# EAGLE design relay (EAGLE 7.0.0)
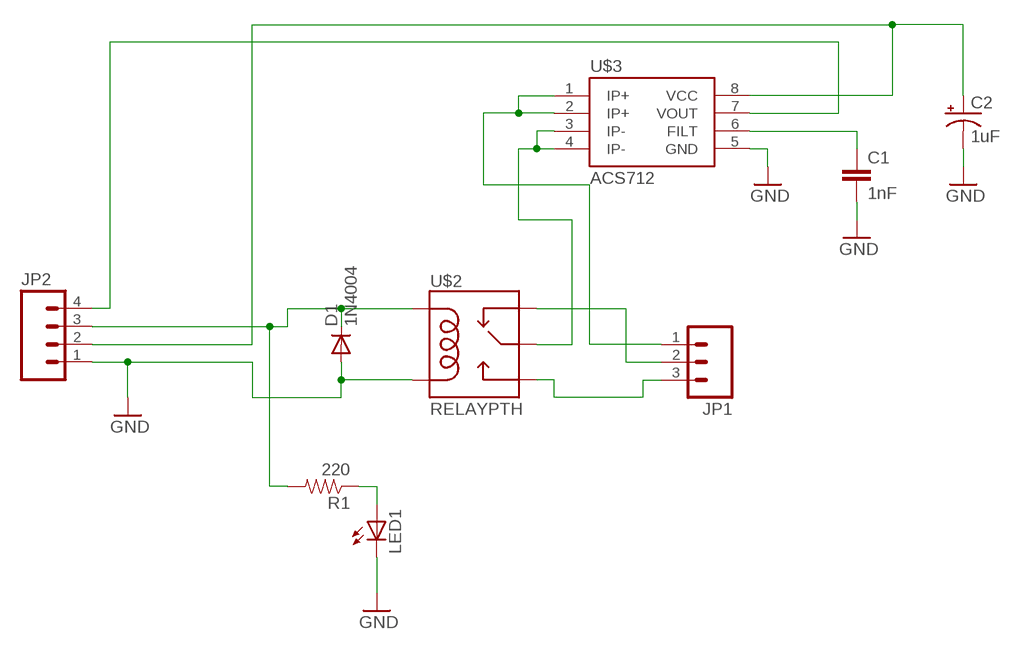
[diagram p0: schematic, sheet 1]

## Parts
C1  1nF  CAPKIT  [CAP-PTH-SMALL-KIT]
C2  1uF  CAP_POLPTH2  [CPOL-RADIAL-10UF-25V]
D1  1N4004  [DO41-10]
JP1  M03SCREW  [SCREWTERMINAL-3.5MM-3]
JP2  M04PTH  [1X04]
LED1  LED3MM  [LED3MM]
R1  220  RESISTORAXIAL-0.3  [AXIAL-0.3]
U$2  RELAYPTH  [RELAY-G5Q]
U$3  ACS712  [SO08]

## Nets
GND: C1.2 C2.2(-) D1.A JP2.1 LED1.K(C) U$2.1(COIL2) U$3.5(GND)
N$1: LED1.A R1.P$1
N$2: D1.C JP2.3 R1.P$2 U$2.5(COIL1)
N$3: C1.1 U$3.6(FILT)
N$4: JP1.2 U$2.4(NC)
N$5: U$2.2(MAIN) U$3.3(IP-) U$3.4(IP-)
N$6: JP1.1 U$3.1(IP+) U$3.2(IP+)
N$7: JP1.3 U$2.3(NO)
N$9: C2.1(+) JP2.2 U$3.8(VCC)
N$19: JP2.4 U$3.7(VOUT)

## Library data of the parts
C1 = SparkFun-Capacitors:CAP: Capacitor Standard 0603 ceramic capacitor, and 0.1" leaded capacitor.
C2 = SparkFun-Capacitors:CAP_POL: Capacitor Polarized These are standard SMD and PTH capacitors. Normally 10uF, 47uF, and 100uF in electrolytic and tantalum varieties. Always verify the external diameter of the through hole cap, it varies with capacity, voltage, and manufacturer. The EIA devices should be standard.
D1 = adafruit:1N4004: DIODE General purpose 1N400x type rectifier (With bigger pads) http://www.ladyada.net/library/pcb/eaglelibrary.html
JP1 = SparkFun-Connectors:M03: Header 3 Standard 3-pin 0.1" header. Use with straight break away headers (SKU : PRT-00116), right angle break away headers (PRT-00553), swiss pins (PRT-00743), machine pins (PRT-00117), and female headers (PRT-00115). Molex polarized connector foot print use with SKU : PRT-08232 with associated crimp pins and housings.
JP2 = SparkFun-Connectors:M04: Header 4 Standard 4-pin 0.1" header. Use with straight break away headers (SKU : PRT-00116), right angle break away headers (PRT-00553), swiss pins (PRT-00743), machine pins (PRT-00117), and female headers (PRT-00115). Molex polarized connector foot print use with SKU : PRT-08231 with associated crimp pins and housings. 1MM SMD Version SKU: PRT-10208
LED1 = SparkFun-LED:LED: LEDs Standard schematic elements and footprints for 5mm, 3mm, 1206, and 0603 sized LEDs. 5mm - Spark Fun Electronics SKU : COM-00529 (and others)
R1 = SparkFun-Passives:RESISTOR: Resistor Basic schematic elements and footprints for 0603, 1206, and PTH resistors.
U$2 = SparkFun-Electromechanical:RELAY: SPDT relay (COM-00101)
U$3 = SparkFun-AnalogIC:ACS712: Hall-effect-based isolated linear current sensor

## Board
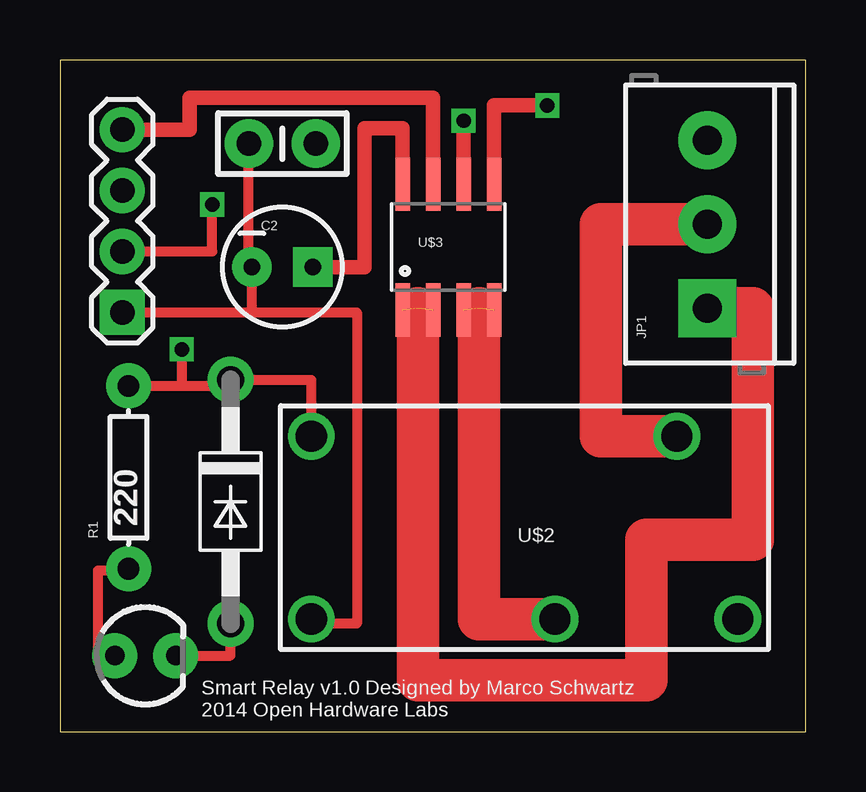
[diagram p1: board, top side]
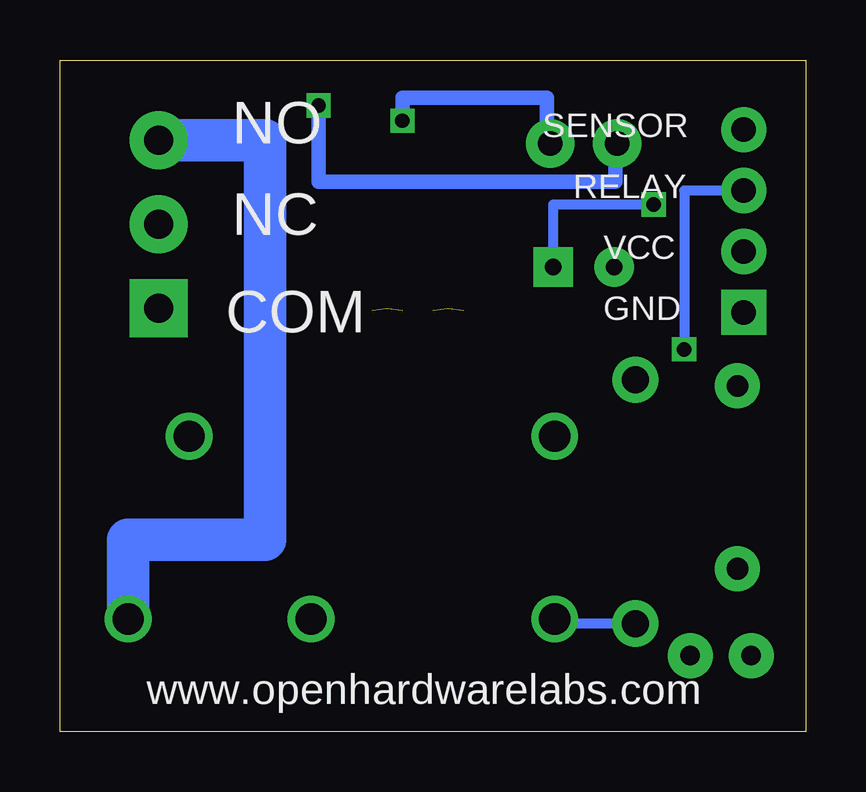
[diagram p2: board, bottom side, seen from below]

Size 31.1 x 27.99 mm. Coordinates in mm from the lower left corner, seen from the top.
Outline: 0,0 31.1,0 31.1,27.99 0,27.99 0,0
Copper layers (1*16): Top 0.035mm / dielectric 1.5mm / Bottom 0.035mm
Design rules "default": minimum track width 10mil, minimum drill 24mil, track to track 8mil, track to pad 8mil, pad to pad 8mil, via to via 8mil, smd to smd 8mil, copper to edge 40mil, drill to drill 8mil, minimum pad ring 10mil, minimum via ring 8mil, stop-mask expansion 4mil, vias tented up to drill 0mil, thermal gap 10mil

### Footprints (pad centres in the part's own frame; a part is rotated, then mirrored left to right if it is on the bottom)
CAP-PTH-SMALL-KIT = drill 1.016 pad 2.032: 1 -1.397,0; 2 1.397,0
CPOL-RADIAL-10UF-25V = drill 0.7 pad 1.651 square: 1 1.27,0 | drill 0.7 pad 1.651: 2 -1.27,0
DO41-10 = drill 1.118 pad 1.93: A 5.08,0; C -5.08,0
SCREWTERMINAL-3.5MM-3 = drill 1.2 pad 2.413 square: 1 0,0 | drill 1.2 pad 2.413: 2 3.5,0; 3 7,0
1X04 = drill 1.016 pad 1.88 square: 1 0,0 | drill 1.016 pad 1.88: 2 2.54,0; 3 5.08,0; 4 7.62,0
LED3MM = drill 0.813 pad 1.88: A -1.27,0; K 1.27,0
AXIAL-0.3 = drill 0.9 pad 1.88: P$1 -3.81,0; P$2 3.81,0
RELAY-G5Q = drill 1.3: 1 8.89,3.81; 2 -1.27,3.81; 3 -8.89,3.81; 4 -6.35,-3.81; 5 8.89,-3.81
SO08 = smd 0.61 x 2.21: 1 -1.905,-2.616; 2 -0.635,-2.616; 3 0.635,-2.616; 4 1.905,-2.616; 5 1.905,2.616; 6 0.635,2.616; 7 -0.635,2.616; 8 -1.905,2.616

### Placement (x,y rotation side)
C1  9.27,24.51 180 top
C2  9.27,19.37 0 top
D1  7.11,9.59 270 top
JP1  26.99,17.65 90 top
JP2  2.6,17.48 90 top
LED1  3.56,3.17 0 top
R1  2.86,10.6 90 top
U$2  19.37,8.51 180 top
U$3  16.19,20.19 0 top

### Tracks (layer width: path | path; a pad name or v marks a point on that pad's centre or on a via)
GND  (via drill 0.6)
  Top 0.406: LED1.K 7.11,3.17 D1.A | C1.2 7.87,19.37 C2.2 8,17.47 | JP2.1 8,17.47 | 8,17.47 12.38,17.47 12.38,4.51 10.48,4.51 U$2.1
  Top 0.61: v20.32,26.1 18.1,26.1 U$3.5
  Bottom 0.406: D1.A 10.48,4.51 U$2.1
  Bottom 0.61: C1.2 7.94,24.51 7.94,22.92 20.32,22.92 v20.32,26.1
N$1
  Top 0.406: LED1.A 1.59,3.17 1.59,6.73 2.86,6.73 R1.P$1
N$2  (via drill 0.6)
  Top 0.406: R1.P$2 5.08,14.41 | 5.08,14.41 7.11,14.41 D1.C 10.48,14.67 U$2.5 | v5.08,15.94 5.08,14.41
  Bottom 0.406: JP2.3 5.08,22.55 v5.08,15.94
N$3  (via drill 0.6)
  Top 0.61: v16.83,25.46 U$3.6
  Bottom 0.61: C1.1 10.79,24.51 10.79,26.42 16.83,26.42 v16.83,25.46
N$4
  Top 1.778: JP1.2 22.54,21.15 22.54,12.32 U$2.4
N$5  (2 unrouted)
  Top 1.778: U$2.2 17.46,4.7 17.46,17.65
N$6  (2 unrouted)
  Top 1.778: JP1.1 28.89,17.65 28.89,8 24.45,8 24.45,2.16 14.92,2.16 14.92,17.65
N$7
  Bottom 1.778: JP1.3 22.54,24.65 22.54,8 28.26,8 U$2.3
N$9  (via drill 0.6)
  Top 0.406: JP2.2 6.35,20.02 v6.35,21.97
  Top 0.61: C2.1 12.7,19.37 12.7,25.15 14.29,25.15 U$3.8
  Bottom 0.406: v6.35,21.97 10.54,21.97 C2.1
N$19
  Top 0.61: JP2.4 5.4,25.09 5.4,26.42 15.56,26.42 U$3.7

### Text on the board
tPlace: Smart Relay v1.0 Designed by Marco Schwartz / 2014 Open Hardware Labs
bPlace: SENSOR | NO | RELAY | NC | VCC | GND | COM | www.openhardwarelabs.com